# EAGLE design bord (EAGLE 6.3)
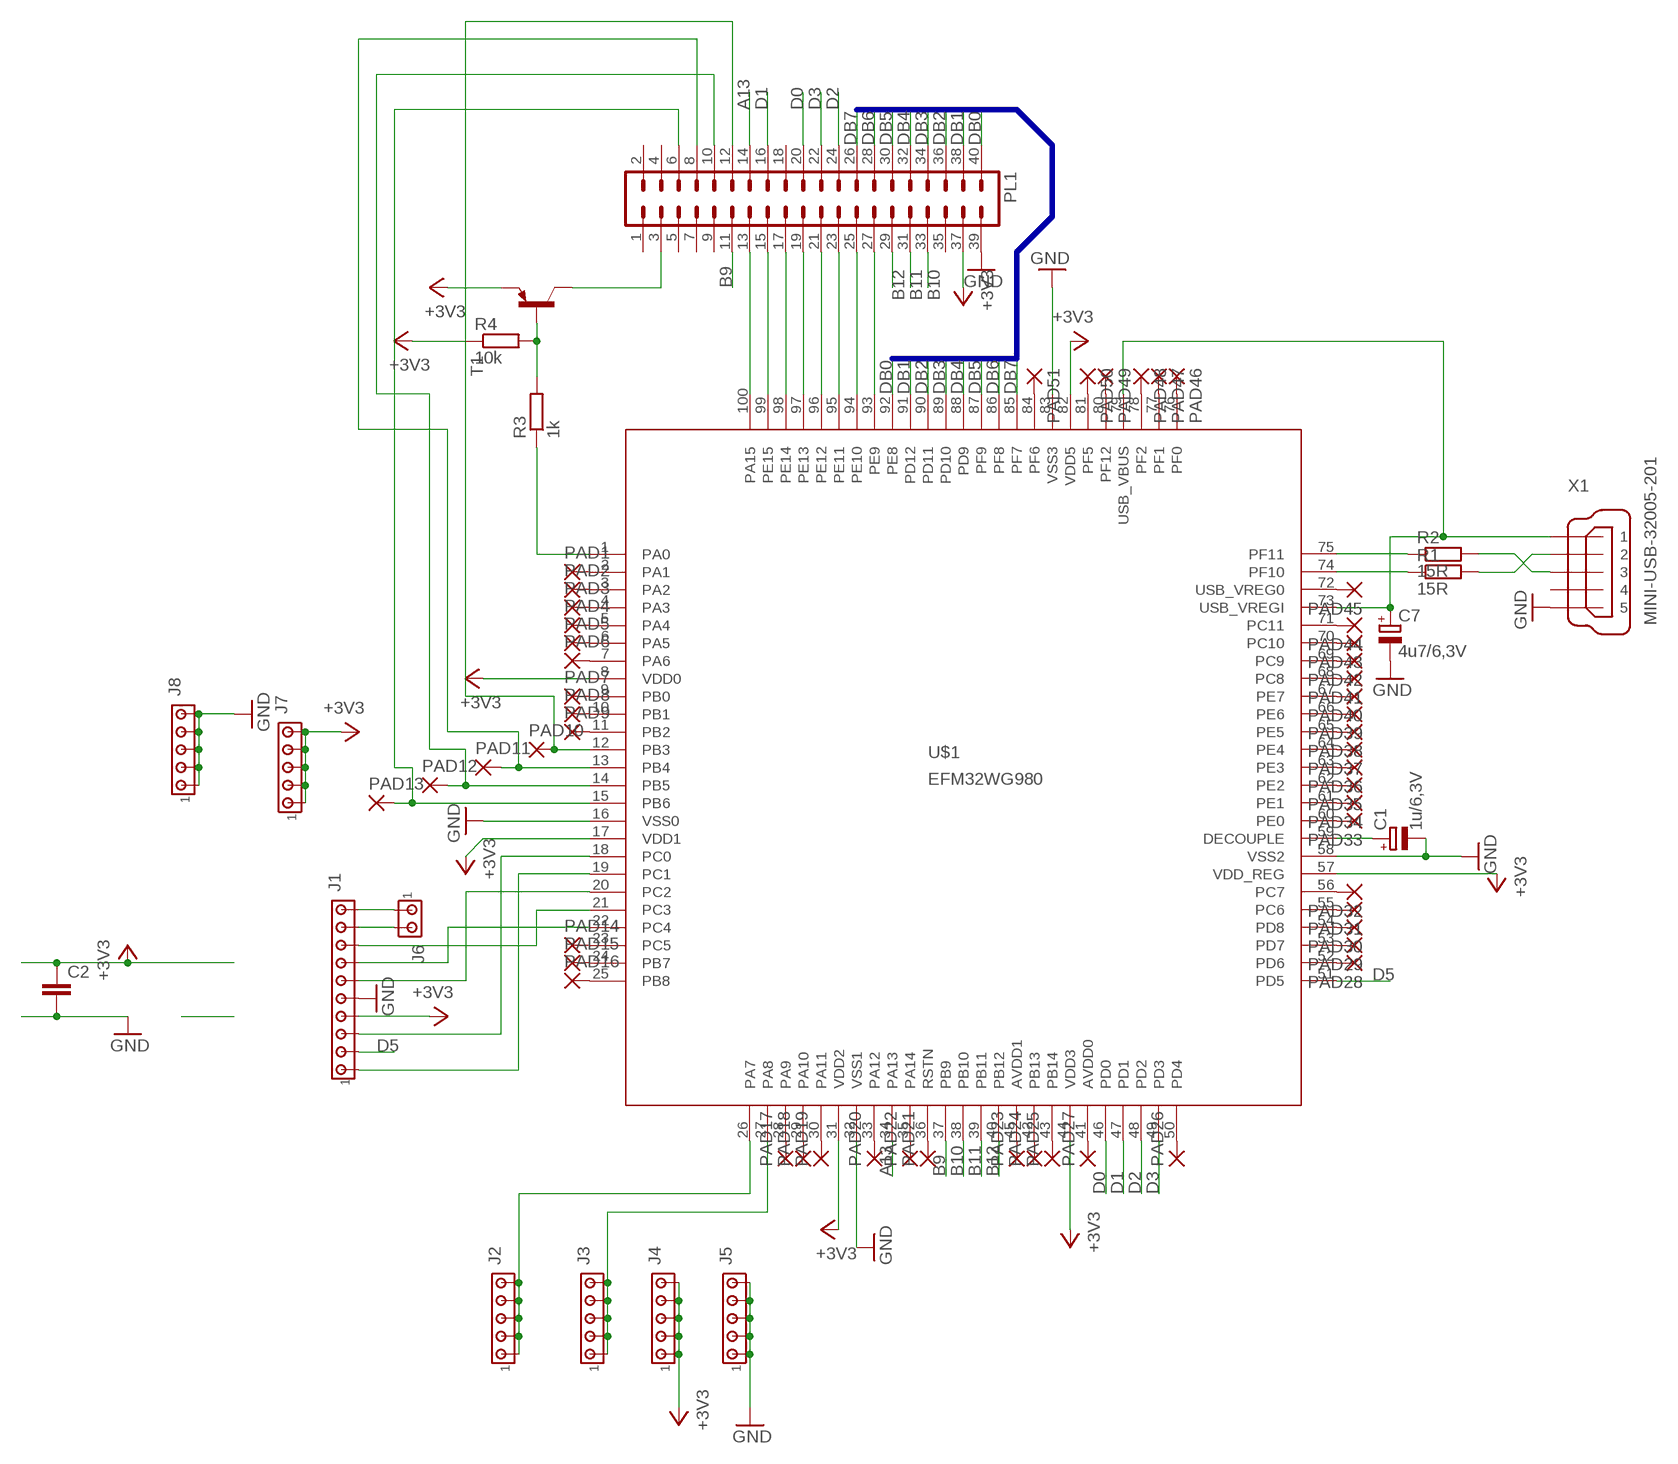
[diagram p0: schematic, sheet 1]

## Parts
C1  1u/6,3V  CPOL-EUSMCB  [SMC_B]
C2  C-EUC0603  [C0603]
C7  4u7/6,3V  CPOL-EUSMCB  [SMC_B]
J1  MTA10-100  [10X10MTA]
J2  MTA05-100  [10X05MTA]
J3  MTA05-100  [10X05MTA]
J4  MTA05-100  [10X05MTA]
J5  MTA05-100  [10X05MTA]
J6  MTA02-100  [10X02MTA]
J7  MTA05-100  [10X05MTA]
J8  MTA05-100  [10X05MTA]
PAD1  1,6/0,8  [1,6/0,8]
PAD2  1,6/0,8  [1,6/0,8]
PAD3  1,6/0,8  [1,6/0,8]
PAD4  1,6/0,8  [1,6/0,8]
PAD5  1,6/0,8  [1,6/0,8]
PAD6  1,6/0,8  [1,6/0,8]
PAD7  1,6/0,8  [1,6/0,8]
PAD8  1,6/0,8  [1,6/0,8]
PAD9  1,6/0,8  [1,6/0,8]
PAD10  1,6/0,8  [1,6/0,8]
PAD11  1,6/0,8  [1,6/0,8]
PAD12  1,6/0,8  [1,6/0,8]
PAD13  1,6/0,8  [1,6/0,8]
PAD14  1,6/0,8  [1,6/0,8]
PAD15  1,6/0,8  [1,6/0,8]
PAD16  1,6/0,8  [1,6/0,8]
PAD17  1,6/0,8  [1,6/0,8]
PAD18  1,6/0,8  [1,6/0,8]
PAD19  1,6/0,8  [1,6/0,8]
PAD20  1,6/0,8  [1,6/0,8]
PAD21  1,6/0,8  [1,6/0,8]
PAD22  1,6/0,8  [1,6/0,8]
PAD23  1,6/0,8  [1,6/0,8]
PAD24  1,6/0,8  [1,6/0,8]
PAD25  1,6/0,8  [1,6/0,8]
PAD26  1,6/0,8  [1,6/0,8]
PAD27  1,6/0,8  [1,6/0,8]
PAD28  1,6/0,8  [1,6/0,8]
PAD29  1,6/0,8  [1,6/0,8]
PAD30  1,6/0,8  [1,6/0,8]
PAD31  1,6/0,8  [1,6/0,8]
PAD32  1,6/0,8  [1,6/0,8]
PAD33  1,6/0,8  [1,6/0,8]
PAD34  1,6/0,8  [1,6/0,8]
PAD35  1,6/0,8  [1,6/0,8]
PAD36  1,6/0,8  [1,6/0,8]
PAD37  1,6/0,8  [1,6/0,8]
PAD38  1,6/0,8  [1,6/0,8]
PAD39  1,6/0,8  [1,6/0,8]
PAD40  1,6/0,8  [1,6/0,8]
PAD41  1,6/0,8  [1,6/0,8]
PAD42  1,6/0,8  [1,6/0,8]
PAD43  1,6/0,8  [1,6/0,8]
PAD44  1,6/0,8  [1,6/0,8]
PAD45  1,6/0,8  [1,6/0,8]
PAD46  1,6/0,8  [1,6/0,8]
PAD47  1,6/0,8  [1,6/0,8]
PAD48  1,6/0,8  [1,6/0,8]
PAD49  1,6/0,8  [1,6/0,8]
PAD50  1,6/0,8  [1,6/0,8]
PAD51  1,6/0,8  [1,6/0,8]
PL1  40V  [40V]
R1  15R  R-EU_M0805  [M0805]
R2  15R  R-EU_M0805  [M0805]
R3  1k  R-EU_M0805  [M0805]
R4  10k  R-EU_M0805  [M0805]
T1  BC807-16-PNP-SOT23-BEC  [SOT23-BEC]
U$1  EFM32WG980  [LQFP100]
X1  MINI-USB-32005-201  [32005-201]

## Nets
+3V3: C2.1 J1.4 J4.1 J4.2 J4.3 J4.4 J4.5 J7.1 J7.2 J7.3 J7.4 J7.5 PL1.37 R4.1 T1.E U$1.8(VDD0) U$1.17(VDD1) U$1.31(VDD2) U$1.44(VDD3) U$1.57(VDD_REG) U$1.82(VDD5)
A13: PL1.14 U$1.34(PA13)
B9: PL1.11 U$1.37(PB9)
B10: PL1.33 U$1.38(PB10)
B11: PL1.31 U$1.39(PB11)
B12: PL1.29 U$1.40(PB12)
D0: PL1.20 U$1.46(PD0)
D1: PL1.16 U$1.47(PD1)
D2: PL1.24 U$1.48(PD2)
D3: PL1.22 U$1.49(PD3)
D5: J1.2 U$1.51(PD5)
DB0: PL1.40 U$1.92(PE8)
DB1: PL1.38 U$1.91(PD12)
DB2: PL1.36 U$1.90(PD11)
DB3: PL1.34 U$1.89(PD10)
DB4: PL1.32 U$1.88(PD9)
DB5: PL1.30 U$1.87(PF9)
DB6: PL1.28 U$1.86(PF8)
DB7: PL1.26 U$1.85(PF7)
GND: C1.- C2.2 C7.- J1.5 J5.1 J5.2 J5.3 J5.4 J5.5 J8.1 J8.2 J8.3 J8.4 J8.5 PL1.39 U$1.16(VSS0) U$1.32(VSS1) U$1.58(VSS2) U$1.83(VSS3) X1.5
N$1: C1.+ U$1.59(DECOUPLE)
N$2: J1.3 U$1.18(PC0)
N$3: J1.1 U$1.19(PC1)
N$4: PAD1.1(P) U$1.2(PA1)
N$5: PAD2.1(P) U$1.3(PA2)
N$6: PAD3.1(P) U$1.4(PA3)
N$7: PAD4.1(P) U$1.5(PA4)
N$8: PAD5.1(P) U$1.6(PA5)
N$9: PAD6.1(P) U$1.7(PA6)
N$10: R1.1 U$1.74(PF10)
N$11: R2.1 U$1.75(PF11)
N$12: R2.2 X1.3
N$13: R1.2 X1.2
N$14: C7.+ U$1.73(USB_VREGI) U$1.79(USB_VBUS) X1.1
N$15: J1.7 U$1.22(PC4)
N$16: R3.2 R4.2 T1.B
N$17: R3.1 U$1.1(PA0)
N$18: PL1.13 U$1.100(PA15)
N$19: PL1.15 U$1.99(PE15)
N$20: PL1.17 U$1.98(PE14)
N$21: PL1.19 U$1.97(PE13)
N$22: PL1.21 U$1.96(PE12)
N$23: PL1.23 U$1.95(PE11)
N$24: PL1.25 U$1.94(PE10)
N$25: PL1.27 U$1.93(PE9)
N$26: PL1.3 T1.C
N$27: J1.6 U$1.20(PC2)
N$28: J1.8 U$1.21(PC3)
N$29: J2.1 J2.2 J2.3 J2.4 J2.5 U$1.26(PA7)
N$30: J3.1 J3.2 J3.3 J3.4 J3.5 U$1.27(PA8)
N$31: PAD7.1(P) U$1.9(PB0)
N$32: PAD8.1(P) U$1.10(PB1)
N$33: PAD9.1(P) U$1.11(PB2)
N$34: PAD10.1(P) PL1.12 U$1.12(PB3)
N$35: PAD11.1(P) PL1.8 U$1.13(PB4)
N$36: PAD12.1(P) PL1.10 U$1.14(PB5)
N$37: PAD13.1(P) PL1.6 U$1.15(PB6)
N$38: PAD14.1(P) U$1.23(PC5)
N$39: PAD15.1(P) U$1.24(PB7)
N$40: PAD16.1(P) U$1.25(PB8)
N$41: PAD17.1(P) U$1.28(PA9)
N$42: PAD18.1(P) U$1.29(PA10)
N$43: PAD19.1(P) U$1.30(PA11)
N$44: PAD20.1(P) U$1.33(PA12)
N$45: PAD21.1(P) U$1.36(RSTN)
N$46: PAD23.1(P) U$1.45(AVDD1)
N$47: PAD24.1(P) U$1.42(PB13)
N$48: PAD25.1(P) U$1.43(PB14)
N$49: PAD26.1(P) U$1.50(PD4)
N$50: PAD27.1(P) U$1.41(AVDD0)
N$51: PAD28.1(P) U$1.52(PD6)
N$52: PAD29.1(P) U$1.53(PD7)
N$53: PAD30.1(P) U$1.54(PD8)
N$54: PAD31.1(P) U$1.55(PC6)
N$55: PAD32.1(P) U$1.56(PC7)
N$56: PAD33.1(P) U$1.60(PE0)
N$57: PAD34.1(P) U$1.61(PE1)
N$58: PAD35.1(P) U$1.62(PE2)
N$59: PAD36.1(P) U$1.63(PE3)
N$60: PAD37.1(P) U$1.64(PE4)
N$61: PAD38.1(P) U$1.65(PE5)
N$62: PAD39.1(P) U$1.66(PE6)
N$63: PAD40.1(P) U$1.67(PE7)
N$64: PAD41.1(P) U$1.68(PC8)
N$65: PAD42.1(P) U$1.69(PC9)
N$66: PAD43.1(P) U$1.70(PC10)
N$67: PAD44.1(P) U$1.71(PC11)
N$68: PAD45.1(P) U$1.72(USB_VREG0)
N$69: PAD46.1(P) U$1.76(PF0)
N$70: PAD47.1(P) U$1.77(PF1)
N$71: PAD48.1(P) U$1.78(PF2)
N$72: PAD49.1(P) U$1.80(PF12)
N$73: PAD50.1(P) U$1.81(PF5)
N$74: PAD51.1(P) U$1.84(PF6)
N$75: PAD22.1(P) U$1.35(PA14)
N$77: J1.10 J6.1
N$78: J1.9 J6.2
Unconnected: PL1.1 PL1.2 PL1.4 PL1.5 PL1.7 PL1.9 PL1.18 PL1.35 X1.4

## Buses
DB[0..7]

## Library data of the parts
C1 C7 = rcl:CPOL-EU: POLARIZED CAPACITOR, European symbol
C2 = rcl:C-EU: CAPACITOR, European symbol
J1 = con-amp:MTA10-100: AMP connector
J2-J5 J7 J8 = con-amp:MTA05-100: AMP connector
J6 = con-amp:MTA02-100: AMP connector
PAD1-PAD51 = wirepad:1,6/0,8: THROUGH-HOLE PAD
PL1 = con-harting-v:40V: CONNECTOR; OC_FARNELL: unknown; OC_NEWARK: unknown
R1-R4 = rcl:R-EU_: RESISTOR, European symbol
T1 = transistor:*-PNP-: PNP Transistror
U$1 = ref-packages:EFM32WG980
X1 = con-cypressindustries:MINI-USB-: MINI USB-B Conector Source: www.cypressindustries.com; OC_FARNELL: unknown; OC_NEWARK: unknown

## Net classes
0 default: width 0.35 mm, drill 0.8 mm, clearance 0.5 mm

## Board
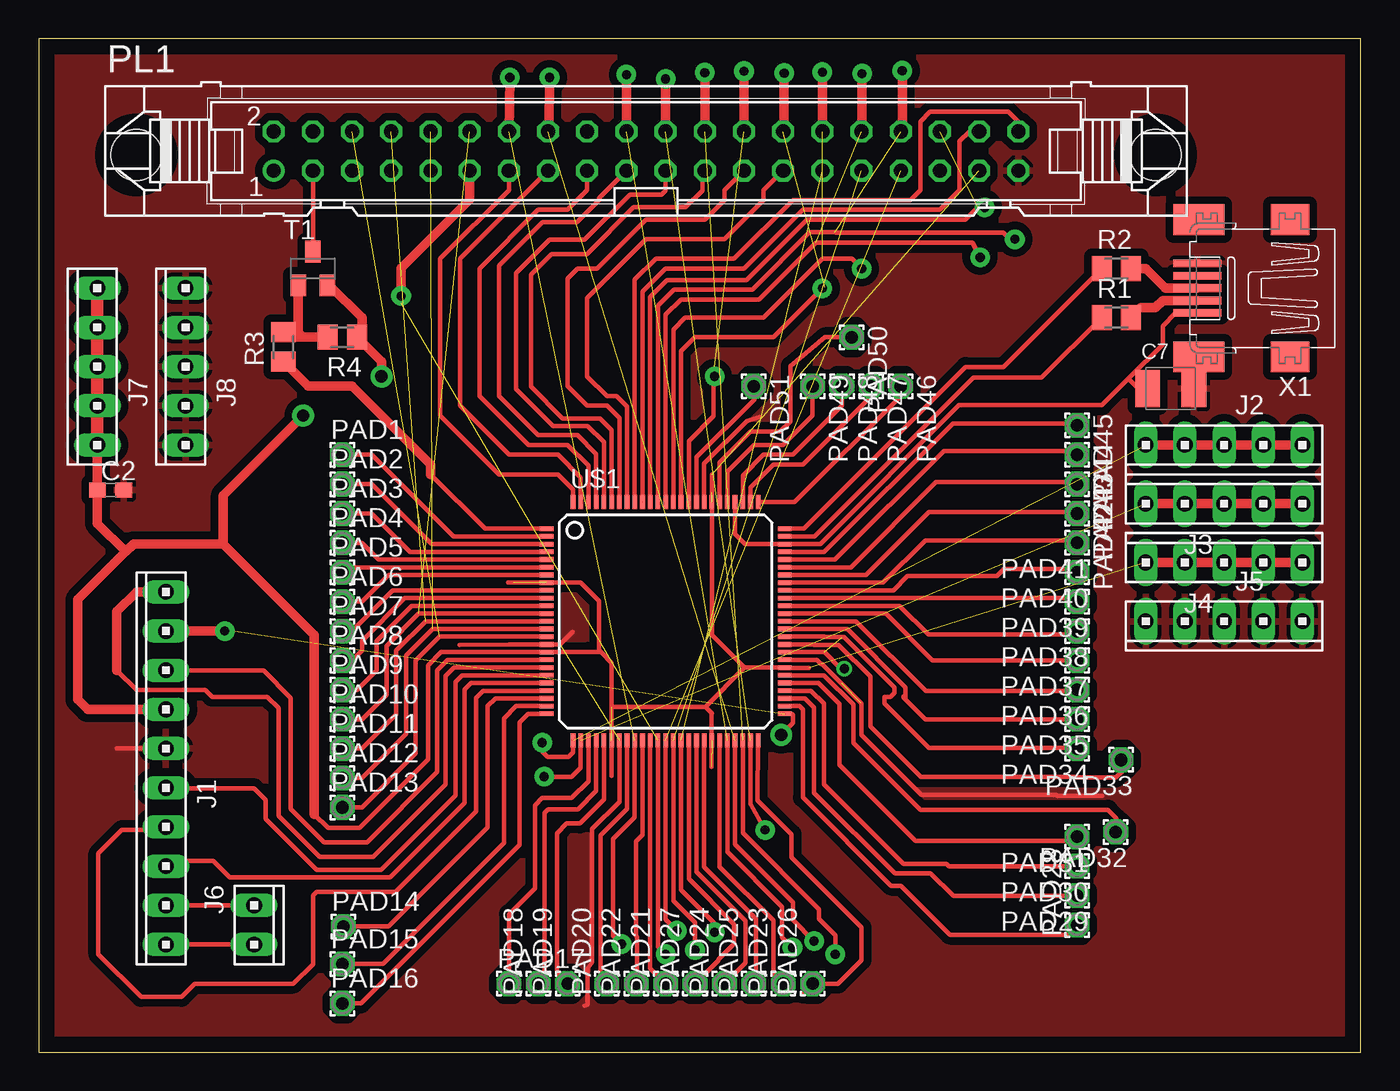
[diagram p1: board, top side]
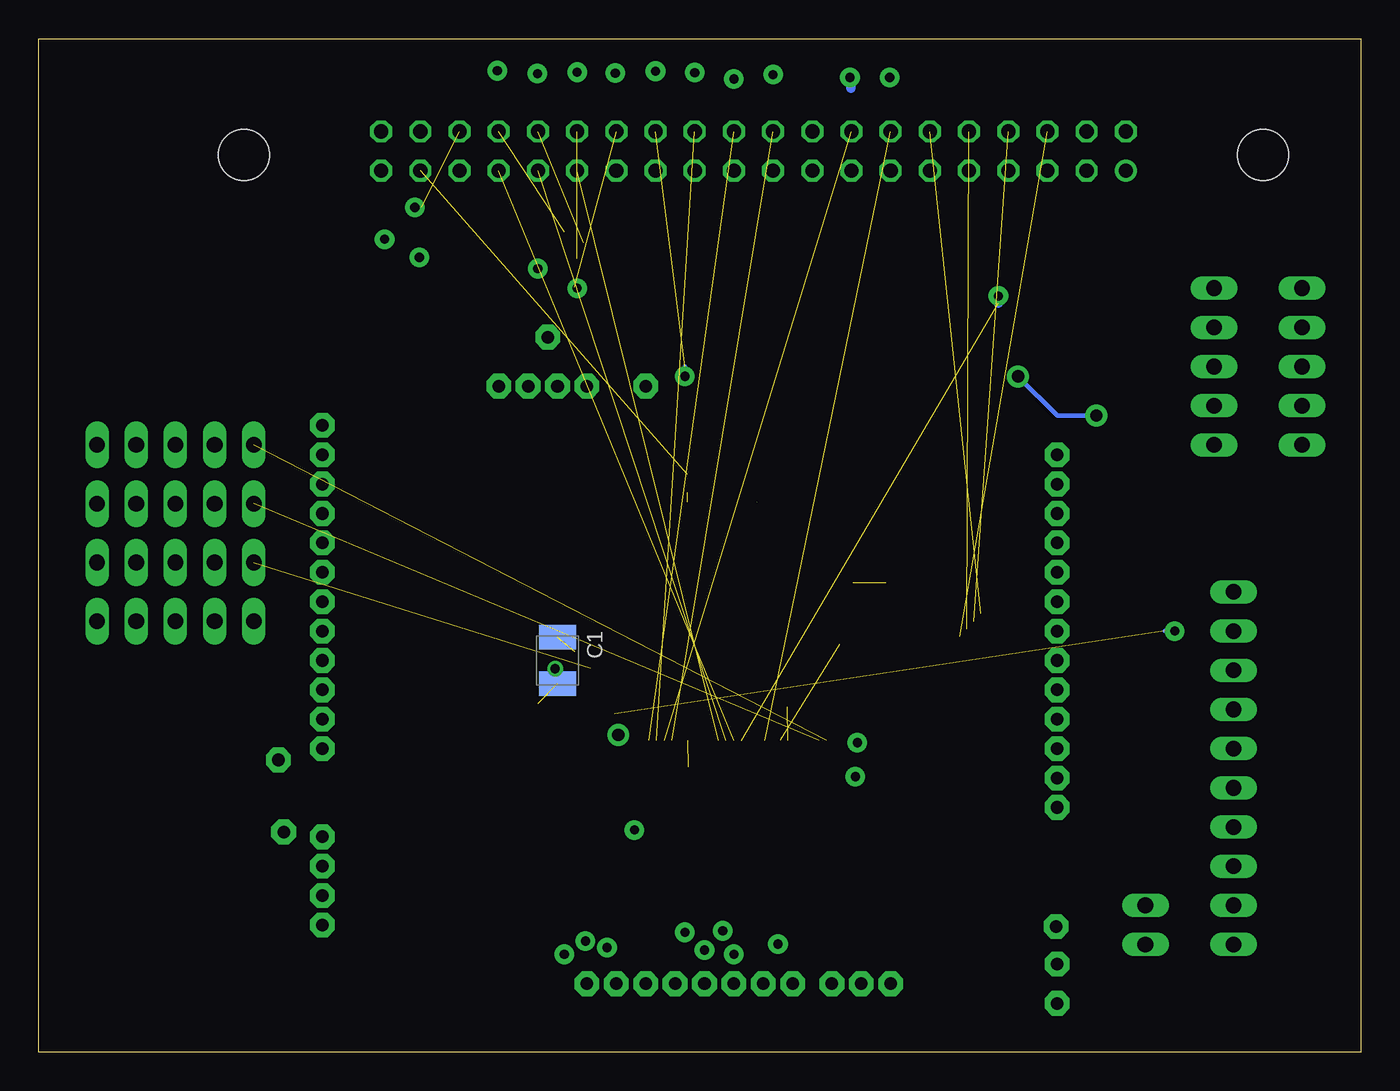
[diagram p2: board, bottom side, seen from below]

Size 85.7 x 65.71 mm. Coordinates in mm from the lower left corner, seen from the top.
Outline: 0,0 85.7,0 85.7,65.71 0,65.71 0,0
Copper layers (1*16): Top 0.035mm / dielectric 1.5mm / Bottom 0.035mm
Design rules "default": minimum track width 10mil, minimum drill 24mil, track to track 8mil, track to pad 8mil, pad to pad 8mil, via to via 8mil, smd to smd 8mil, copper to edge 40mil, drill to drill 8mil, minimum pad ring 10mil, minimum via ring 8mil, stop-mask expansion 4mil, vias tented up to drill 0mil, thermal gap 10mil

### Footprints (pad centres in the part's own frame; a part is rotated, then mirrored left to right if it is on the bottom)
SMC_B = smd 1.6 x 2.4: + -1.5,0; - 1.5,0
C0603 = smd 1.1 x 1: 1 -0.85,0; 2 0.85,0
10X10MTA = drill 1.016 long: 1 11.43,0; 2 8.89,0; 3 6.35,0; 4 3.81,0; 5 1.27,0; 6 -1.27,0; 7 -3.81,0; 8 -6.35,0; 9 -8.89,0; 10 -11.43,0
10X05MTA = drill 1.016 long: 1 5.08,0; 2 2.54,0; 3 0,0; 4 -2.54,0; 5 -5.08,0
10X02MTA = drill 1.016 long: 1 1.27,0; 2 -1.27,0
1,6/0,8 = drill 0.813 pad 1.6 octagon: 1 0,0
40V = drill 0.914: 1 -24.13,-1.27 | drill 0.914 octagon: 2 -24.13,1.27; 3 -21.59,-1.27; 4 -21.59,1.27; 5 -19.05,-1.27; 6 -19.05,1.27; 7 -16.51,-1.27; 8 -16.51,1.27; 9 -13.97,-1.27; 10 -13.97,1.27; 11 -11.43,-1.27; 12 -11.43,1.27; 13 -8.89,-1.27; 14 -8.89,1.27; 15 -6.35,-1.27; 16 -6.35,1.27; 17 -3.81,-1.27; 18 -3.81,1.27; 19 -1.27,-1.27; 20 -1.27,1.27; 21 1.27,-1.27; 22 1.27,1.27; 23 3.81,-1.27; 24 3.81,1.27; 25 6.35,-1.27; 26 6.35,1.27; 27 8.89,-1.27; 28 8.89,1.27; 29 11.43,-1.27; 30 11.43,1.27; 31 13.97,-1.27; 32 13.97,1.27; 33 16.51,-1.27; 34 16.51,1.27; 35 19.05,-1.27; 36 19.05,1.27; 37 21.59,-1.27; 38 21.59,1.27; 39 24.13,-1.27; 40 24.13,1.27 | hole 3.302: 33.02,-0.254; -33.02,-0.254
M0805 = smd 1.3 x 1.6: 1 -0.95,0; 2 0.95,0
SOT23-BEC = smd 1 x 1.4: B -0.95,-1.1; C 0,1.1; E 0.95,-1.1
LQFP100 = smd 0.9 x 0.3: 1 -7.72,6; 2 -7.72,5.5; 3 -7.72,5; 4 -7.72,4.5; 5 -7.72,4; 6 -7.72,3.5; 7 -7.72,3; 8 -7.72,2.5; 9 -7.72,2; 10 -7.72,1.5; 11 -7.72,1; 12 -7.72,0.5; 13 -7.72,0; 14 -7.72,-0.5; 15 -7.72,-1; 16 -7.72,-1.5; 17 -7.72,-2; 18 -7.72,-2.5; 19 -7.72,-3; 20 -7.72,-3.5; 21 -7.72,-4; 22 -7.72,-4.5; 23 -7.72,-5; 24 -7.72,-5.5; 25 -7.72,-6; 51 7.72,-6; 52 7.72,-5.5; 53 7.72,-5; 54 7.72,-4.5; 55 7.72,-4; 56 7.72,-3.5; 57 7.72,-3; 58 7.72,-2.5; 59 7.72,-2; 60 7.72,-1.5; 61 7.72,-1; 62 7.72,-0.5; 63 7.72,0; 64 7.72,0.5; 65 7.72,1; 66 7.72,1.5; 67 7.72,2; 68 7.72,2.5; 69 7.72,3; 70 7.72,3.5; 71 7.72,4; 72 7.72,4.5; 73 7.72,5; 74 7.72,5.5; 75 7.72,6 | smd 0.3 x 0.9: 26 -6,-7.72; 27 -5.5,-7.72; 28 -5,-7.72; 29 -4.5,-7.72; 30 -4,-7.72; 31 -3.5,-7.72; 32 -3,-7.72; 33 -2.5,-7.72; 34 -2,-7.72; 35 -1.5,-7.72; 36 -1,-7.72; 37 -0.5,-7.72; 38 0,-7.72; 39 0.5,-7.72; 40 1,-7.72; 41 1.5,-7.72; 42 2,-7.72; 43 2.5,-7.72; 44 3,-7.72; 45 3.5,-7.72; 46 4,-7.72; 47 4.5,-7.72; 48 5,-7.72; 49 5.5,-7.72; 50 6,-7.72; 76 6,7.72; 77 5.5,7.72; 78 5,7.72; 79 4.5,7.72; 80 4,7.72; 81 3.5,7.72; 82 3,7.72; 83 2.5,7.72; 84 2,7.72; 85 1.5,7.72; 86 1,7.72; 87 0.5,7.72; 88 0,7.72; 89 -0.5,7.72; 90 -1,7.72; 91 -1.5,7.72; 92 -2,7.72; 93 -2.5,7.72; 94 -3,7.72; 95 -3.5,7.72; 96 -4,7.72; 97 -4.5,7.72; 98 -5,7.72; 99 -5.5,7.72; 100 -6,7.72
32005-201 = smd 3.1 x 0.5: 1 3,1.6; 2 3,0.8; 3 3,0; 4 3,-0.8; 5 3,-1.6 | smd 2.5 x 2: M1 -3,-4.45; M2 -3,4.45 | smd 3.3 x 2: M3 2.9,4.45; M4 2.9,-4.45

### Placement (x,y rotation side)
C1  52.07,25.4 270 bottom
C2  4.67,36.45 0 top
C7  73.37,43.02 0 top
J1  8.25,18.41 90 top
J2  76.84,39.37 180 top
J3  76.84,35.56 0 top
J4  76.84,31.75 0 top
J5  76.84,27.94 180 top
J6  13.97,8.26 270 top
J7  3.81,44.45 90 top
J8  9.52,44.45 90 top
PAD1  19.68,38.73 0 top
PAD2  19.68,36.83 0 top
PAD3  19.68,34.92 0 top
PAD4  19.68,33.02 0 top
PAD5  19.68,31.12 0 top
PAD6  19.68,29.21 0 top
PAD7  19.68,27.3 0 top
PAD8  19.68,25.4 0 top
PAD9  19.68,23.49 0 top
PAD10  19.68,21.59 0 top
PAD11  19.68,19.69 0 top
PAD12  19.68,17.78 0 top
PAD13  19.68,15.88 0 top
PAD14  19.75,8.16 0 top
PAD15  19.68,5.71 0 top
PAD16  19.68,3.18 0 top
PAD17  30.48,4.45 0 top
PAD18  32.39,4.45 90 top
PAD19  34.29,4.45 90 top
PAD20  36.83,4.45 90 top
PAD21  40.64,4.45 90 top
PAD22  38.73,4.45 90 top
PAD23  48.26,4.45 90 top
PAD24  44.45,4.45 90 top
PAD25  46.36,4.45 90 top
PAD26  50.17,4.45 90 top
PAD27  42.55,4.45 90 top
PAD28  67.31,8.26 90 top
PAD29  67.31,10.16 180 top
PAD30  67.31,12.06 180 top
PAD31  67.31,13.97 180 top
PAD32  69.82,14.29 180 top
PAD33  70.17,18.95 180 top
PAD34  67.31,19.69 180 top
PAD35  67.31,21.59 180 top
PAD36  67.31,23.49 180 top
PAD37  67.31,25.4 180 top
PAD38  67.31,27.3 180 top
PAD39  67.31,29.21 180 top
PAD40  67.31,31.12 180 top
PAD41  67.31,33.02 180 top
PAD42  67.31,34.92 270 top
PAD43  67.31,36.83 270 top
PAD44  67.31,38.73 270 top
PAD45  67.31,40.64 270 top
PAD46  55.88,43.18 270 top
PAD47  53.98,43.18 270 top
PAD48  52.07,43.18 270 top
PAD49  50.17,43.18 270 top
PAD50  52.7,46.35 270 top
PAD51  46.36,43.18 270 top
PL1  39.37,58.42 0 top
R1  69.85,47.62 0 top
R2  69.85,50.8 0 top
R3  15.88,45.72 90 top
R4  19.68,46.35 180 top
T1  17.78,50.8 0 top
U$1  40.64,27.94 0 top
X1  78.11,49.53 180 top

### Tracks (layer width: path | path; a pad name or v marks a point on that pad's centre or on a via)
+3V3  (via drill 0.8 pad 1.42)  (6 unrouted)
  Top 0.305: 35.53,25.94 U$1.17 26.1,25.94 25.24,25.08 25.24,18.99 20.8,14.54 18.76,14.54 17.88,15.43 | 36.45,25.94 37.14,25.25 37.14,22.41 | 43.21,22.38 43.64,21.95 43.62,21.94 43.62,18.51 | 43.21,22.38 37.17,22.38 37.14,22.41 | 45.77,24.94 U$1.57 48.38,24.92 49.94,24.92 | 45.77,24.94 43.21,22.38 | 45.77,24.94 43.64,27.07 43.66,36.29 43.66,37.46 | 36.45,25.94 35.53,25.94 | 35.53,25.94 | 36.45,25.94 36.32,26.07 36.32,29.24 35.12,30.44 30.43,30.44 30.8,30.45 | 20.95,46.67 R4.1 | 37.14,22.41 37.14,17.91 37.15,17.91
  Top 0.61: 17.88,15.43 17.88,27.05 11.97,32.96 | 11.97,32.96 6.16,32.96 5.65,32.45 | 5.65,32.45 2.54,29.34 2.54,22.86 3.18,22.23 J1.4 | T1.E 18.88,49.7 20.95,47.62 20.95,46.67 | 11.97,32.96 11.97,36.1 v17.14,41.27 | v22.22,43.81 22.22,44.77 R4.1 | J4.5 J4.4 J4.3 J4.2 J4.1 | J7.5 C2.1 | 5.65,32.45 3.81,34.29 3.81,35.08 C2.1 | C2.1
  Top 0.813: J7.1 J7.2 J7.3 J7.4 J7.5
  Bottom 0.305: v17.14,41.27 19.68,41.27 v22.22,43.81
A13  (via drill 0.6 pad 1.27)  (1 unrouted)
  Top 0.305: U$1.34 38.64,15.24 37.24,13.84 37.24,7.56 v37.78,7.02
  Top 0.61: PL1.14 v30.54,63.18
  Bottom 0.305: v37.78,7.02 37.78,6.83
  Bottom 0.61: v30.54,63.18 30.48,62.99
B9  (via drill 0.6 pad 1.27)  (1 unrouted)
  Top 0.305: U$1.37 40.14,6.85 v40.64,6.35
  Top 0.61: PL1.11 27.94,55.28 23.5,50.83 v23.5,49.02
  Bottom 0.305: v40.64,6.35 40.77,6.35 40.8,6.32
  Bottom 0.61: v23.5,49.02 23.5,48.58
B10  (via drill 0.6 pad 1.27)  (1 unrouted)
  Top 0.305: U$1.38 40.64,8.6 v41.37,7.87
  Bottom 0.305: v41.37,7.87 41.37,7.78 41.4,7.75 41.28,7.62
B11  (via drill 0.6 pad 1.27)  (1 unrouted)
  Top 0.305: U$1.39 41.14,9.82 42.55,8.41 v42.55,6.64
  Bottom 0.305: v42.55,6.64 42.58,6.64 42.67,6.54
B12  (via drill 0.6 pad 1.27)  (1 unrouted)
  Top 0.305: U$1.40 41.64,10.53 43.81,8.35 v43.81,7.78
  Bottom 0.305: v43.81,7.78 43.81,7.75 43.88,7.68
D0  (via drill 0.6 pad 1.27)  (1 unrouted)
  Top 0.305: U$1.46 44.64,12.99 48.2,9.43 48.2,7.46 v48.86,6.79
  Top 0.61: PL1.20 v38.1,63.37
  Bottom 0.305: v48.86,6.79 48.86,6.57 48.99,6.45
  Bottom 0.61: v38.1,63.37 38.13,63.4 38.13,63.47
D1  (via drill 0.6 pad 1.27)  (1 unrouted)
  Top 0.305: U$1.47 45.14,13.47 48.89,9.72 48.89,8.57 v50.26,7.21
  Top 0.61: PL1.16 33.08,59.75 v33.11,63.18
  Bottom 0.305: v50.26,7.21 50.26,6.92 50.36,6.83
  Bottom 0.61: v33.11,63.18 33.05,62.48 33.05,63.18
D2  (via drill 0.6 pad 1.27)  (1 unrouted)
  Top 0.305: U$1.48 45.64,14.21 50.58,9.27 50.58,8.67 51.66,7.59 51.66,6.38 v51.62,6.35
  Top 0.61: PL1.24 v43.18,63.5
  Bottom 0.305: v51.62,6.35 51.18,6.41
  Bottom 0.61: v43.18,63.5 43.37,63.69 43.47,63.69
D3  (via drill 0.6 pad 1.27)  (1 unrouted)
  Top 0.305: U$1.49 46.13,16.1 v47.08,14.42
  Top 0.61: PL1.22 v40.64,63.09
  Bottom 0.305: v47.08,14.42 47.28,14.45
  Bottom 0.61: v40.64,63.09 40.64,63.4
D5  (via drill 0.6 pad 1.27, 0.8 pad 1.42)  (1 unrouted)
  Top 0.305: U$1.51 48.83,21.94 48.89,21.88 48.89,21.34 v48.13,20.57
  Top 0.61: J1.2 v12.07,27.3
  Bottom 0.305: v12.07,27.3 12.7,27.3
DB0
  Top 0.305: U$1.92 38.64,50.07 40,51.43 45.08,51.43 48.89,55.24 56.52,55.24 57.15,55.88 57.15,60.32 57.78,60.96 62.87,60.96 63.5,60.32 PL1.40
DB1  (1 unrouted)
  Top 0.305: U$1.91 39.15,49.31 40.64,50.8 45.72,50.8 49.53,54.61 58.42,54.61 59.69,55.88 59.69,59.05 60.33,59.69 PL1.38
DB2  (via drill 0.6 pad 1.27)  (1 unrouted)
  Top 0.305: U$1.90 39.64,48.94 40.73,50.04 45.88,50.04 49.82,53.98 60.07,53.98 60.87,54.77 v61.31,54.77
  Bottom 0.305: v61.31,54.77 61.44,54.77 61.47,54.74
DB3  (via drill 0.6 pad 1.27)  (1 unrouted)
  Top 0.305: U$1.89 40.13,48.39 41.18,49.43 46.26,49.43 49.97,53.15 51.62,53.15 51.66,53.12 62.55,53.12 62.96,52.7 v63.28,52.7 63.28,53.12
  Top 0.61: PL1.34 55.98,59.79 v55.98,63.63
  Bottom 0.305: v63.28,52.7 63.44,52.55 63.56,52.55
  Bottom 0.61: v55.98,63.63 56.07,63.72 56.26,63.72
DB4  (via drill 0.6 pad 1.27)  (1 unrouted)
  Top 0.305: U$1.88 40.64,47.82 41.62,48.8 46.7,48.8 50.39,52.48 60.52,52.48 v61.02,51.53
  Top 0.61: PL1.32 53.37,59.72 v53.37,63.44
  Bottom 0.305: v61.02,51.53 61.06,51.82
  Bottom 0.61: v53.37,63.44 53.44,63.5 53.44,63.66
DB5  (via drill 0.6 pad 1.27)  (1 unrouted)
  Top 0.305: U$1.87 41.14,46.85 41.91,47.62 46.99,47.62 50.8,51.43 52.7,51.43 v53.34,50.8
  Top 0.61: PL1.30 v50.8,63.53
  Bottom 0.305: v53.34,50.8 53.34,50.89
  Bottom 0.61: v50.8,63.53 50.86,63.59 50.96,63.59
DB6  (via drill 0.6 pad 1.27)  (1 unrouted)
  Top 0.305: U$1.86 41.64,45.45 42.55,46.35 47.62,46.35 v50.8,49.53
  Top 0.61: PL1.28 48.32,59.75 v48.32,63.47
  Bottom 0.305: v50.8,49.53 50.89,49.53 50.96,49.59
  Bottom 0.61: v48.32,63.47 48.42,63.56 48.42,63.63
DB7  (via drill 0.6 pad 1.27)  (1 unrouted)
  Top 0.305: U$1.85 42.14,39.63 43.75,41.24 43.75,43.18 v43.81,43.81
  Top 0.61: PL1.26 v45.72,63.59
  Bottom 0.305: v43.81,43.81 43.81,44.45
  Bottom 0.61: v45.72,63.59 45.78,63.66 45.78,63.72
GND  (2 unrouted)
  Top 0.305: 33.81,26.44 U$1.16 30.74,26.44 30.48,26.45 | 33.81,26.44 34.61,27.24 | J1.5 5.08,19.69 | U$1.32 37.64,16.24 35.88,14.48 35.88,5.84 35.59,5.4 35.59,3.08 35.37,3.02 | U$1.58 50.45,25.43 50.7,25.18 50.77,25.18 53.34,22.61 53.34,20.57 57.21,16.7 65.98,16.7 66.04,16.64 68.96,16.64 | U$1.83 43.14,38.16 45.91,40.93 46.74,41.18 | 33.81,26.44 27.27,26.42
  pour Top: -1.27,-1.9 86.36,-2.54 86.36,66.04 0,66.04
N$1  (via drill 0.6 pad 0.81)  (1 unrouted)
  Top 0.305: U$1.59 | U$1.59 50.93,25.94 52.01,24.86 v52.23,24.86
  Bottom 0.305: v52.23,24.86 52.36,24.73 52.36,24.67 52.32,24.67
N$2
  Top 0.305: U$1.18 26.52,25.44 25.85,24.77 25.85,18.16 21.3,13.62 18.51,13.62 16.35,15.78 16.35,22.99 14.57,24.77 J1.3
N$3
  Top 0.305: U$1.19 26.94,24.94 26.38,24.38 26.38,17.37 21.68,12.67 18.22,12.67 15.56,15.33 15.56,22.32 14.83,23.05 11.24,23.05 10.79,23.49 6.35,23.49 5.08,24.77
  Top 0.61: 5.08,24.77 5.08,28.57 6.35,29.84 J1.1
N$4
  Top 0.305: U$1.2 26.89,33.44 21.59,38.73 PAD1.1
N$5
  Top 0.305: U$1.3 25.48,32.94 21.59,36.83 PAD2.1
N$6
  Top 0.305: U$1.4 24.07,32.44 21.59,34.92 PAD3.1
N$7
  Top 0.305: U$1.5 22.04,31.94 20.95,33.02 PAD4.1
N$8
  Top 0.305: U$1.6 20.01,31.44 PAD5.1
N$9
  Top 0.305: U$1.7 22.68,30.94 20.95,29.21 PAD6.1
N$10
  Top 0.305: U$1.74 50.3,33.44 60.58,43.72 65,43.72 R1.1
N$11
  Top 0.305: U$1.75 49.59,33.94 60.07,44.42 62.52,44.42 R2.1
N$12
  Top 0.61: X1.3 73.03,49.53 71.76,50.8 R2.2
N$13
  Top 0.305: 71.44,48.26 R1.2
  Top 0.61: X1.2 72.86,48.73 72.39,48.26 71.44,48.26
N$14
  Top 0.305: 45.18,33.56 45.14,33.6 U$1.79 45.14,33.63 45.18,33.59 45.18,33.56 | 45.78,32.96 45.8,32.94 U$1.73 | 45.18,33.56 45.78,32.96 | 45.78,32.96 50.67,32.96 59.66,41.94 68.93,41.94 70.67,43.69 | X1.1 73.93,47.93 73.88,47.88 73.85,47.91 73.69,47.91 72.87,47.09 72.87,45.88 70.67,43.69 | 70.67,43.69 70.67,43.62 71.28,43.02 C7.+
N$15
  Top 0.305: U$1.22 28.81,23.44 28.35,22.99 28.35,15.62 23.15,10.41 18.03,10.41 17.78,10.16 17.78,5.71 16.51,4.45 10.13,4.45 9.27,3.59 6.64,3.59 3.87,6.35 3.87,12.89 5.4,14.42 8.06,14.42 J1.7
N$16
  Top 0.305: 16.19,46.35 R3.2
  Top 0.61: R4.2 17.14,46.35 | 17.14,46.35 16.19,46.35 | T1.B 16.83,46.67 17.14,46.35
N$17
  Top 0.305: U$1.1 28.93,33.94 25.4,37.46
  Top 0.61: 25.4,37.46 25.4,38.1 20.32,43.18 17.46,43.18 R3.1
N$18
  Top 0.305: U$1.100 34.64,36.48 33.66,37.46 29.85,37.46 26.04,41.27 26.04,51.43 30.48,55.88 PL1.13
N$19
  Top 0.305: U$1.99 35.14,37.25 33.66,38.73 30.48,38.73 27.31,41.91 27.31,51.43 PL1.15
N$20
  Top 0.305: U$1.98 35.64,38.02 34.29,39.37 31.75,39.37 28.57,42.55 28.57,50.8 32.39,54.61 34.29,54.61 35.56,55.88 PL1.17
N$21
  Top 0.305: U$1.97 36.14,38.79 34.92,40 32.39,40 29.85,42.55 29.85,50.99 32.67,53.82 34.89,53.82 36.32,55.24 36.32,55.37 PL1.19
N$22
  Top 0.305: U$1.96 36.64,39.56 35.59,40.61 33.34,40.61 30.96,42.99 30.96,50.51 33.11,52.67 35.4,52.67 38.32,55.59 40.39,55.59 40.64,55.85 PL1.21
N$23
  Top 0.305: U$1.95 37.14,40.33 36.39,41.08 33.97,41.08 31.91,43.15 31.91,50.42 33.24,51.75 35.56,51.75 38.58,54.77 41.94,54.77 43.02,55.85 43.02,56.99 PL1.23
N$24
  Top 0.305: U$1.94 37.64,41.1 36.83,41.91 35.56,41.91 34.29,43.18 34.29,50.16 34.92,50.8 36.19,50.8 39.37,53.98 43.18,53.98 44.45,55.24 44.45,55.88 PL1.25
N$25
  Top 0.305: U$1.93 38.14,41.87 37.47,42.55 36.83,42.55 35.56,43.81 35.56,48.89 39.37,52.7 44.45,52.7 46.99,55.24 46.99,55.88 PL1.27
N$26
  Top 0.305: T1.C PL1.3
N$27
  Top 0.305: U$1.20 27.46,24.44 27.02,24 27.02,16.67 22.19,11.84 18.03,11.84 14.73,15.15 14.73,16.35 13.97,17.11 8.29,17.11 J1.6
N$28
  Top 0.305: U$1.21 28.04,23.94 27.62,23.53 27.62,16.16 22.8,11.33 12.38,11.33 11.3,12.41 8.6,12.41 J1.8
N$29  (via drill 0.6 pad 1.27)  (1 unrouted)
  Top 0.305: U$1.26 34.64,19.43 34.35,19.15 32.99,19.15 32.61,19.53 32.61,20.03 v32.64,20.07
  Top 0.61: J2.1 J2.2 J2.3 | 77.47,39.37 J2.3 | J2.3 J2.4 J2.5
  Bottom 0.305: v32.64,20.07 32.83,20.26
N$30  (via drill 0.6 pad 1.27)  (1 unrouted)
  Top 0.305: U$1.27 35.14,18.44 34.54,17.84 32.8,17.84 v32.77,17.88
  Top 0.61: J3.1 J3.2 J3.3 J3.4 J3.5
  Bottom 0.305: v32.77,17.88 32.77,18.1 32.73,18.13
N$31
  Top 0.305: U$1.9 22.96,29.94 20.32,27.3 PAD7.1
N$32
  Top 0.305: U$1.10 23.72,29.44 20.95,26.67 20.95,26.03 20.32,25.4 PAD8.1
N$33
  Top 0.305: U$1.11 24.18,28.94 21.91,26.67 21.91,24.77 20.64,23.49 PAD9.1
N$34  (1 unrouted)
  Top 0.305: U$1.12 24.63,28.44 22.54,26.35 22.54,23.18 20.95,21.59 PAD10.1
N$35  (1 unrouted)
  Top 0.305: U$1.13 25.08,27.94 23.18,26.03 23.18,21.91 20.95,19.69 PAD11.1
N$36  (1 unrouted)
  Top 0.305: U$1.14 25.54,27.44 23.81,25.72 23.81,20.64 20.95,17.78 PAD12.1
N$37  (1 unrouted)
  Top 0.305: U$1.15 25.99,26.94 24.45,25.4 24.45,19.37 20.95,15.88 PAD13.1
N$38
  Top 0.305: U$1.23 29.61,22.94 29.11,22.45 29.11,14.57 22.7,8.16 PAD14.1
N$39
  Top 0.305: U$1.24 30.95,22.44 30.16,21.65 30.16,13.59 22.32,5.75 19.72,5.75 PAD15.1
N$40
  Top 0.305: U$1.25 31.72,21.94 31.18,21.4 31.18,13.46 20.89,3.18 PAD16.1
N$41
  Top 0.305: U$1.28 35.64,17.57 34.54,16.48 32.64,16.48 32.16,16 32.16,10.64 30.48,8.95 PAD17.1
N$42
  Top 0.305: U$1.29 36.14,16.93 34.96,15.75 33.02,15.75 32.8,15.53 32.8,4.86 PAD18.1
N$43
  Top 0.305: U$1.30 36.64,16.38 35.08,14.83 34.23,14.83 33.59,14.19 33.59,5.14 PAD19.1
N$44
  Top 0.305: U$1.33 38.14,15.79 36.42,14.06 36.42,4.86 PAD20.1
N$45
  Top 0.305: U$1.36 39.64,5.45 PAD21.1
N$46
  Top 0.305: U$1.45 44.14,12.03 47.62,8.54 47.62,5.08 PAD23.1
N$47
  Top 0.305: U$1.42 42.64,11.68 45.81,8.51 45.81,5.81 PAD24.1
N$48
  Top 0.305: U$1.43 43.14,12.01 46.48,8.67 46.48,4.57 PAD25.1
N$49
  Top 0.305: 49.53,3.81 PAD26.1 51.82,4.45 53.34,5.97 53.34,8.1 48.8,12.64 48.8,14.13 46.61,16.32 U$1.50
N$50
  Top 0.305: U$1.41 42.14,11.23 45.08,8.29 45.08,7.05 44.07,6.03 44.07,5.97 PAD27.1
N$51
  Top 0.305: U$1.52 49.31,22.44 49.53,22.23 49.53,16.51 55.25,10.79 55.88,10.79 59.06,7.62 66.67,7.62 PAD28.1
N$52
  Top 0.305: U$1.53 49.67,22.94 50.26,22.35 50.26,16.83 55.5,11.59 57.82,11.59 59.28,10.13 67.28,10.13 PAD29.1
N$53
  Top 0.305: U$1.54 50.06,23.44 50.89,22.61 50.89,17.37 56.04,12.22 58.83,12.22 58.99,12.06 PAD30.1
N$54
  Top 0.305: U$1.55 50.55,23.94 51.91,22.57 51.91,18.64 56.83,13.72 67.06,13.72 PAD31.1
N$55
  Top 0.305: U$1.56 50.9,24.44 52.8,22.54 52.8,20.07 57.15,15.72 69.31,15.72 69.85,15.18 PAD32.1
N$56
  Top 0.305: U$1.60 50.24,26.44 50.26,26.42 51.85,26.42 53.91,24.35 53.91,21.11 57.18,17.84 67.25,17.84 67.25,17.81 69.82,17.81 70.23,18.23 PAD33.1
N$57
  Top 0.305: U$1.61 50.94,26.94 50.96,26.92 52.2,26.92 55.47,23.65 55.47,23.3 55.21,23.05 54.83,23.05 54.83,22.61 57.72,19.72 67.28,19.72 PAD34.1
N$58
  Top 0.305: U$1.62 51.68,27.44 51.69,27.43 52.42,27.43 56.2,23.65 56.2,22.86 | 56.04,23.08 56.04,23.02 56.2,22.86 | 56.2,22.86 57.47,21.59 PAD35.1
N$59
  Top 0.305: U$1.63 52.99,27.94 57.5,23.43 67.25,23.43 PAD36.1
N$60
  Top 0.305: U$1.64 54.9,28.44 57.94,25.4 PAD37.1
N$61
  Top 0.305: U$1.65 55.8,28.94 57.66,27.08 67.09,27.08 PAD38.1
N$62
  Top 0.305: U$1.66 67.08,29.44 PAD39.1
N$63
  Top 0.305: U$1.67 55.4,29.94 56.32,30.86 62.1,30.86 62.58,31.34 67.09,31.34 PAD40.1
N$64
  Top 0.305: U$1.68 54.73,30.44 57.47,33.18 67.15,33.18 PAD41.1
N$65
  Top 0.305: U$1.69 53.61,30.94 57.69,35.02 67.22,35.02 PAD42.1
N$66
  Top 0.305: U$1.70 52.65,31.44 58.17,36.96 67.18,36.96 PAD43.1
N$67
  Top 0.305: U$1.71 51.62,31.94 58.67,38.99 67.06,38.99 PAD44.1
N$68
  Top 0.305: U$1.72 50.92,32.44 59.25,40.77 67.18,40.77 PAD45.1
N$69
  Top 0.305: U$1.76 49,35.66 55.88,42.55 PAD46.1
N$70
  Top 0.305: U$1.77 46.14,36.62 47.62,38.1 49.53,38.1 53.98,42.55 PAD47.1
N$71
  Top 0.305: U$1.78 45.64,37.38 46.99,38.73 48.89,38.73 52.07,41.91 PAD48.1
N$72
  Top 0.305: U$1.80 44.64,37.66 46.36,39.37 48.26,39.37 50.17,41.27 PAD49.1
N$73
  Top 0.305: U$1.81 44.14,38.23 46.13,40.23 48.04,40.23 48.74,40.89 48.74,44.48 50.96,46.35 PAD50.1
N$74
  Top 0.305: U$1.84 42.64,38.58 46.39,42.32 46.39,43.15 PAD51.1
N$75
  Top 0.305: U$1.35 39.14,14.09 38.73,13.68 38.73,7.56 38.8,7.49 38.8,4.19 38.99,4 38.99,4.19 PAD22.1
N$77
  Top 0.305: J1.10 J6.1
N$78
  Top 0.305: J6.2 J1.9